# EasyEDA schematic SCH_touchsensor+mic_2024-07-11.json
TITLE: Touchsensor+mic; REV: 1.0; Date: 2024-07-11; Sheet: 1/1; Company: Your Company
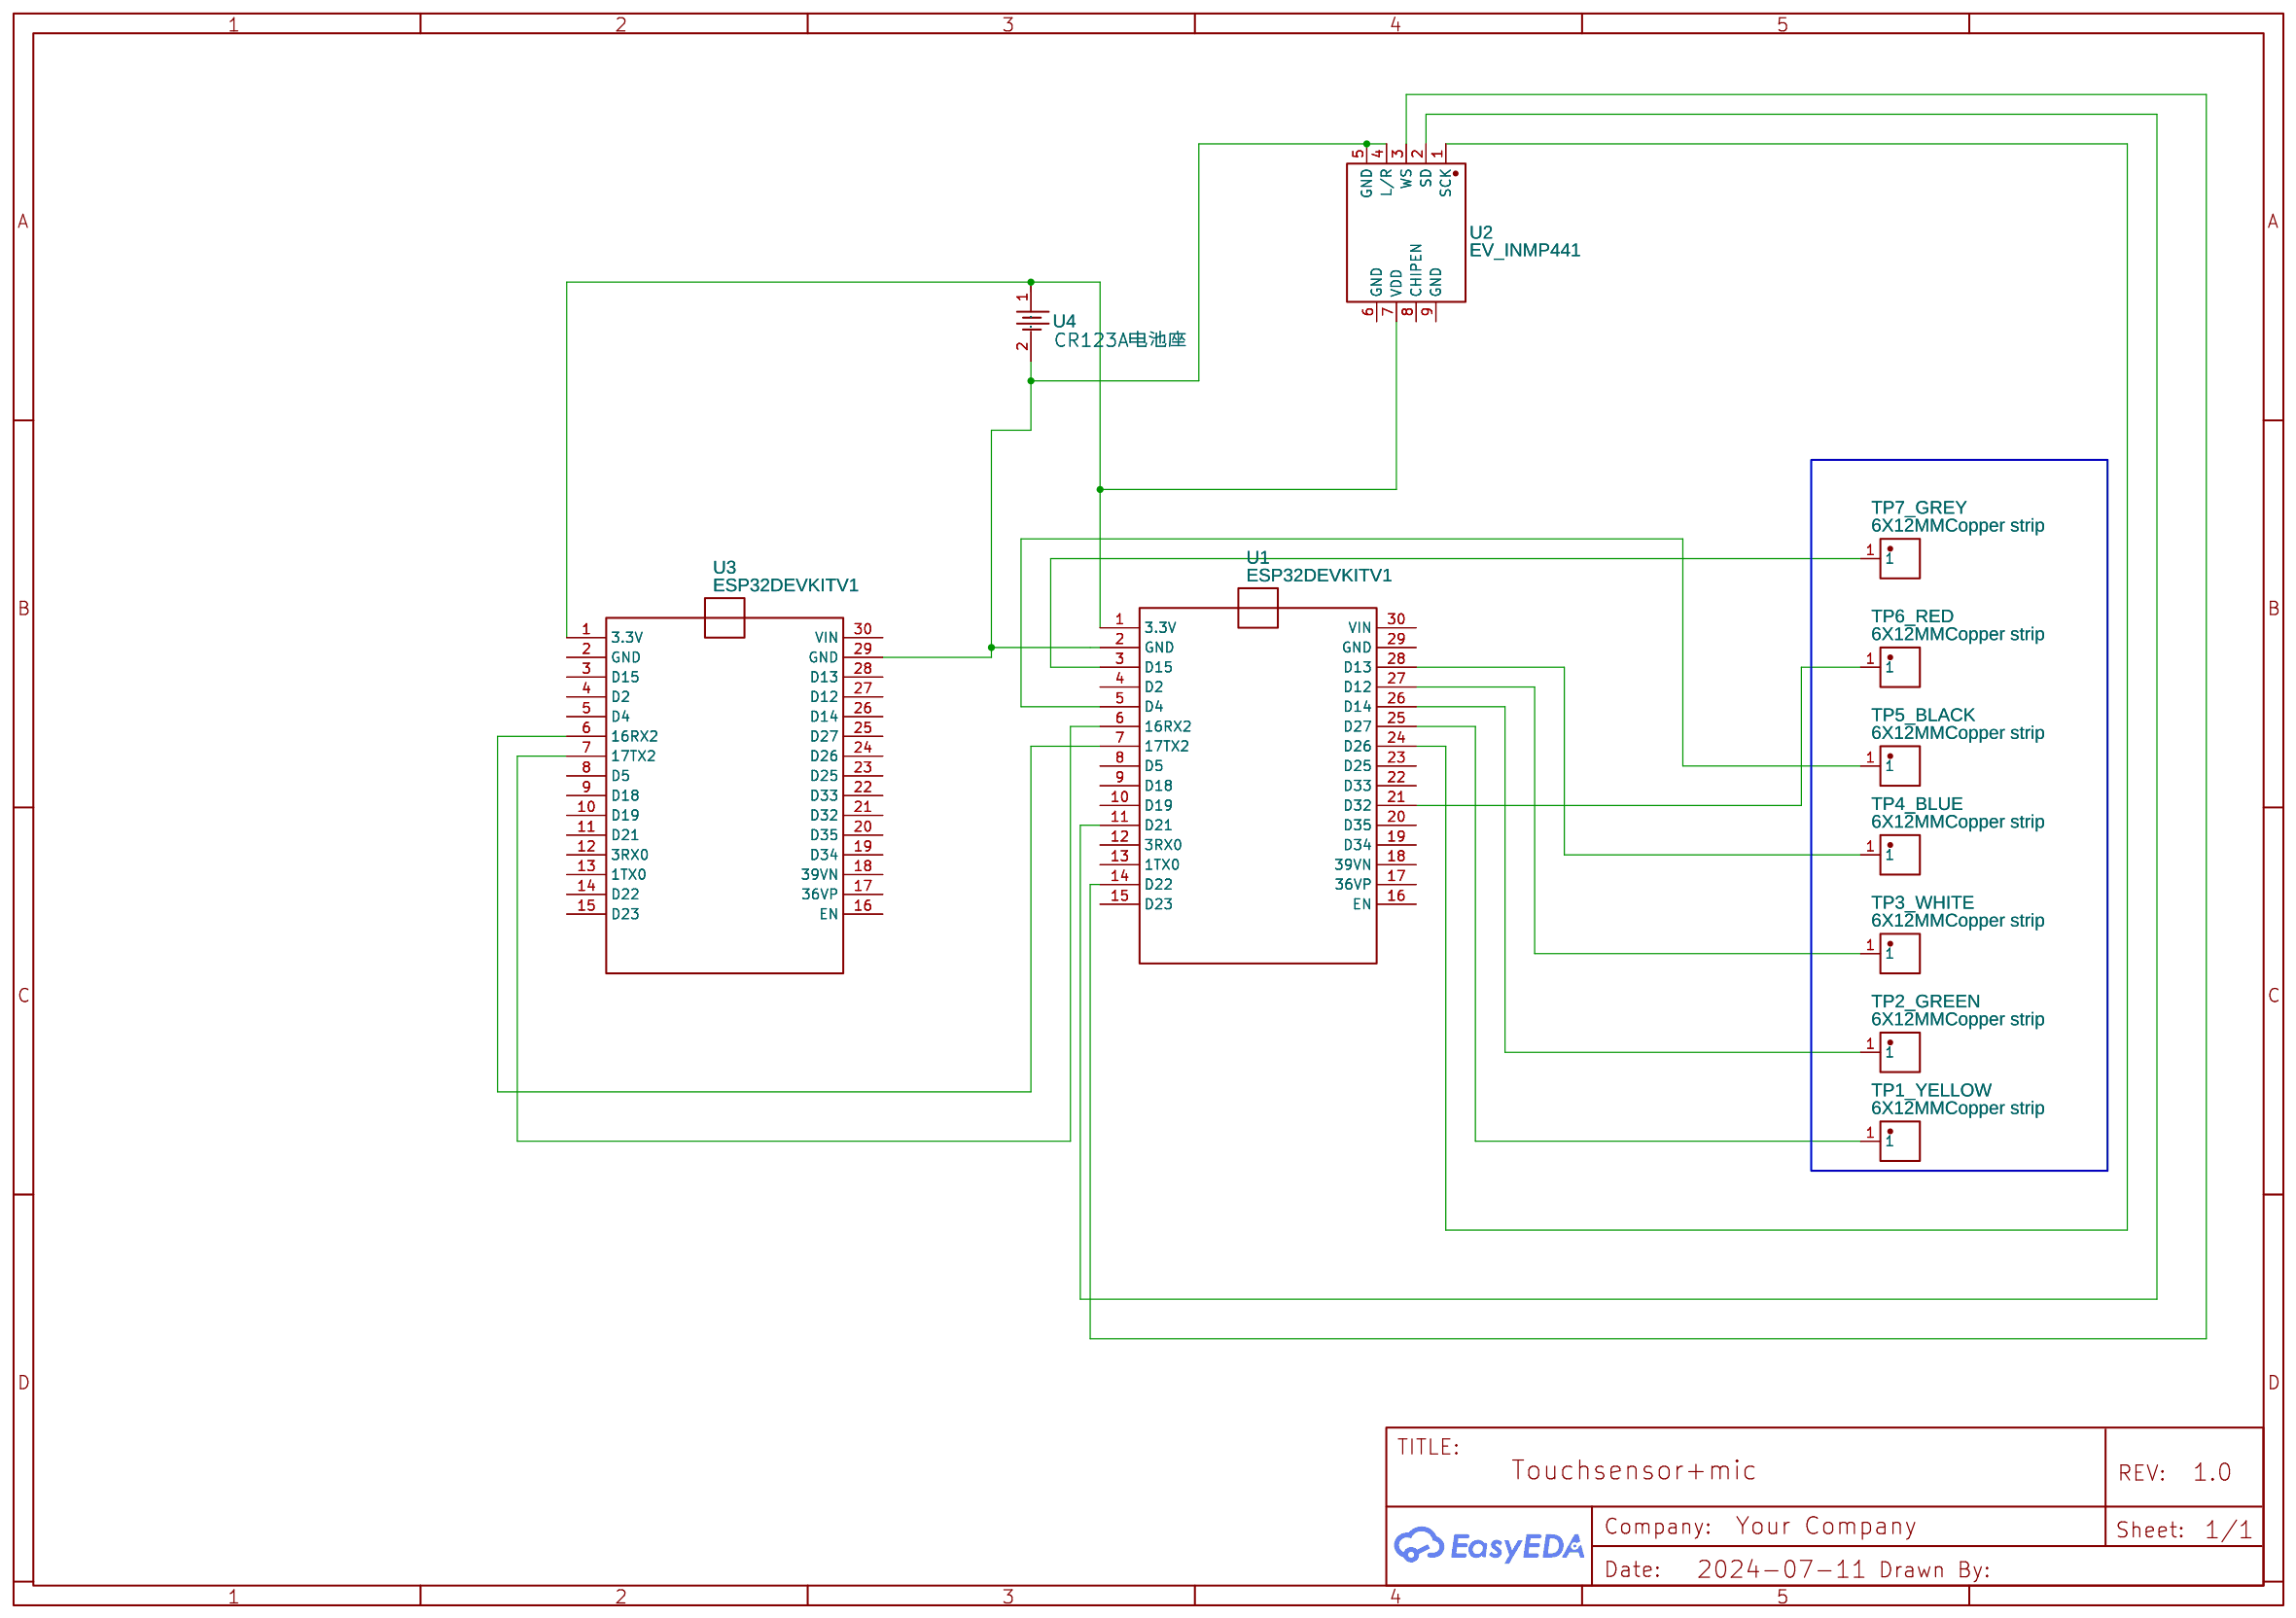
[diagram p0: schematic sheet]

## Parts
TP1_YELLOW  6X12MMCopper strip  [TESTPOINT-SMD_L10.0-W6.0]
TP2_GREEN  6X12MMCopper strip  [TESTPOINT-SMD_L10.0-W6.0]
TP3_WHITE  6X12MMCopper strip  [TESTPOINT-SMD_L10.0-W6.0]
TP4_BLUE  6X12MMCopper strip  [TESTPOINT-SMD_L10.0-W6.0]
TP5_BLACK  6X12MMCopper strip  [TESTPOINT-SMD_L10.0-W6.0]
TP6_RED  6X12MMCopper strip  [TESTPOINT-SMD_L10.0-W6.0]
TP7_GREY  6X12MMCopper strip  [TESTPOINT-SMD_L10.0-W6.0]
U1  ESP32DEVKITV1  [ESP32DEVKITV1]
U2  EV_INMP441  [MID-SMD_L4.7-W3.8_INMP441ACEZ]
U3  ESP32DEVKITV1  [ESP32DEVKITV1]
U4  CR123A电池座  [TH_L43.0-W-18.0-CR123A]

## Library data of the parts
TP1_YELLOW TP2_GREEN TP3_WHITE TP4_BLUE TP5_BLACK TP6_RED TP7_GREY = 6X12MMCopper strip: Contributor: lcsc; Supplier: LCSC; Supplier Part: C9900022349; Manufacturer: null; Manufacturer Part: 6X12mm铜片; JLCPCB Part Class: Extended Part
U1 U3 = ESP32DEVKITV1: Contributor: gadupong
U2 = EV_INMP441: Supplier: LCSC; Supplier Part: C19446972; Manufacturer: TDK InvenSense(应美盛); Contributor: lcsc; JLCPCB Part Class: Extended Part
U4 = CR123A电池座: Contributor: LCSC; Supplier: LCSC; Supplier Part: C2803347; Manufacturer: null; JLCPCB Part Class: Extended Part

## Nets
Net-(TP1_YELLOW-1): TP1_YELLOW.1 U1.25(D27)
Net-(TP2_GREEN-1): TP2_GREEN.1 U1.26(D14)
Net-(TP3_WHITE-1): TP3_WHITE.1 U1.27(D12)
Net-(TP4_BLUE-1): TP4_BLUE.1 U1.28(D13)
Net-(TP5_BLACK-1): TP5_BLACK.1 U1.5(D4)
Net-(TP6_RED-1): TP6_RED.1 U1.21(D32)
Net-(TP7_GREY-1): TP7_GREY.1 U1.3(D15)
Net-(U1-1): U1.1(3.3V) U2.7(VDD) U3.1(3.3V) U4.1
Net-(U1-2): U1.2(GND) U2.4(L/R) U2.5(GND) U3.29(GND) U4.2
Net-(U1-6): U1.6(16RX2) U3.7(17TX2)
Net-(U1-7): U1.7(17TX2) U3.6(16RX2)
Net-(U1-11): U1.11(D21) U2.2(SD)
Net-(U1-14): U1.14(D22) U2.3(WS)
Net-(U1-24): U1.24(D26) U2.1(SCK)

Not connected (* = marked no-connect by the designer): U1 4(D2) 8(D5) 9(D18) 10(D19) 12(3RX0) 13(1TX0) 15(D23) 16(EN) 17(36VP) 18(39VN) 19(D34) 20(D35) 22(D33) 23(D25) 29(GND) 30(VIN); U2 6(GND) 8(CHIPEN) 9(GND); U3 2(GND) 3(D15) 4(D2) 5(D4) 8(D5) 9(D18) 10(D19) 11(D21) 12(3RX0) 13(1TX0) 14(D22) 15(D23) 16(EN) 17(36VP) 18(39VN) 19(D34) 20(D35) 21(D32) 22(D33) 23(D25) 24(D26) 25(D27) 26(D14) 27(D12) 28(D13) 30(VIN)
